# Altium schematic sheet 振弦读数模块小板.SchDoc
size A4
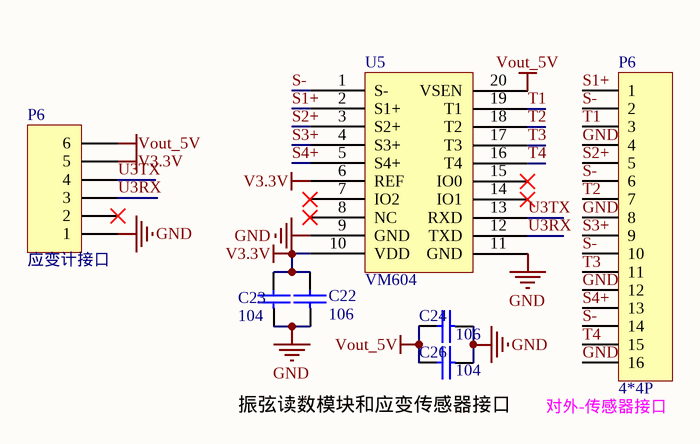
[diagram p0: 振弦读数模块小板.SchDoc]

## Parts
(Parts that share a designator on the sheet are numbered #1, #2 ... from top to bottom, then left to right.)
C22  106  [C0603]
C23  104  [C0603]
C24  106  [C0603]
C26  104  [C0603]
P6#1  4*4P  [MHDR1X16]
P6#2  应变计接口  [HDR1X6H]
U5  VM604  [VM604]

## Nets
GND: C22.1 C23.1 C24.1 C26.1 P6#1.4 P6#1.8 P6#1.12 P6#1.16 P6#2.1 U5.9(GND) U5.11(GND)
V3.3V: C22.2 C23.2 P6#2.5 U5.6(REF) U5.10(VDD)
Vout_5V: C24.2 C26.2 P6#2.6 U5.20(VSEN)
S1+: P6#1.1 U5.2(S1+)
S2+: P6#1.5 U5.3(S2+)
S3+: P6#1.9 U5.4(S3+)
S4+: P6#1.13 U5.5(S4+)
S-: P6#1.2 P6#1.6 P6#1.10 P6#1.14 U5.1(S-)
T1: P6#1.3 U5.19(T1)
T2: P6#1.7 U5.18(T2)
T3: P6#1.11 U5.17(T3)
T4: P6#1.15 U5.16(T4)
U3RX: P6#2.3 U5.12(TXD)
U3TX: P6#2.4 U5.13(RXD)

Not connected (* = marked no-connect by the designer): P6#2 2*; U5 7(IO2)* 8(NC)* 14(IO1)* 15(IO0)*

## Notes on the sheet
- 振弦读数模块和应变传感器接口
- (near P6#1) 对外-传感器接口

## Library data of the parts
C22-C24 C26 = CAP_1: 贴片电容
P6#1 = MHDR1X16: 航空插排（座）16-Pin; LatestRevisionDate: 17-Jul-2002; LatestRevisionNote: Re-released for DXP Platform.; Publisher: Altium Limited
P6#2 = Header 6H: Header, 6-Pin, Right Angle; LatestRevisionDate: 17-Jul-2002; LatestRevisionNote: Re-released for DXP Platform.; Publisher: Altium Limited
U5 = Component_1: 振弦读数模块